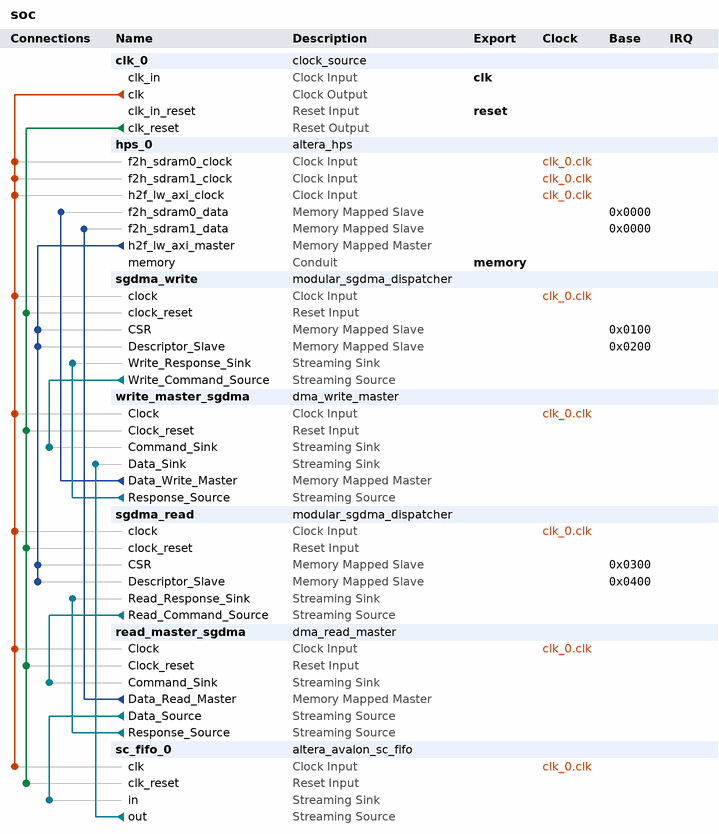
[diagram p0: system contents]
# Platform Designer (Qsys) system soc, Cyclone V 5CSXFC6D6F31C6
# Parameters at their usual value, and those the tool derives, are not listed.
package require -exact qsys 15.0
create_system soc
set_project_property DEVICE_FAMILY {Cyclone V}
set_project_property DEVICE 5CSXFC6D6F31C6

add_instance clk_0 clock_source 15.0
set_instance_parameter_value clk_0 clockFrequency 50000000

add_instance hps_0 altera_hps 15.0
set_instance_parameter_value hps_0 EMAC1_Mode N/A
set_instance_parameter_value hps_0 EMAC1_PinMuxing Unused
set_instance_parameter_value hps_0 F2SCLK_COLDRST_Enable false
set_instance_parameter_value hps_0 F2SCLK_DBGRST_Enable false
set_instance_parameter_value hps_0 F2SCLK_WARMRST_Enable false
set_instance_parameter_value hps_0 F2SDRAM_Type {Avalon-MM Write-Only,Avalon-MM Read-Only}
set_instance_parameter_value hps_0 F2SDRAM_Width 64,64
set_instance_parameter_value hps_0 F2SINTERRUPT_Enable false
set_instance_parameter_value hps_0 F2S_Width 0
set_instance_parameter_value hps_0 FPGA_PERIPHERAL_OUTPUT_CLOCK_FREQ_EMAC0_GTX_CLK 100
set_instance_parameter_value hps_0 FPGA_PERIPHERAL_OUTPUT_CLOCK_FREQ_EMAC0_MD_CLK 2.5
set_instance_parameter_value hps_0 FPGA_PERIPHERAL_OUTPUT_CLOCK_FREQ_EMAC1_GTX_CLK 100
set_instance_parameter_value hps_0 FPGA_PERIPHERAL_OUTPUT_CLOCK_FREQ_EMAC1_MD_CLK 2.5
set_instance_parameter_value hps_0 HPS_PROTOCOL DDR3
set_instance_parameter_value hps_0 I2C0_Mode N/A
set_instance_parameter_value hps_0 I2C0_PinMuxing Unused
set_instance_parameter_value hps_0 I2C1_Mode N/A
set_instance_parameter_value hps_0 I2C1_PinMuxing Unused
set_instance_parameter_value hps_0 LWH2F_Enable true
set_instance_parameter_value hps_0 MEM_BANKADDR_WIDTH 3
set_instance_parameter_value hps_0 MEM_CLK_FREQ 400.0
set_instance_parameter_value hps_0 MEM_COL_ADDR_WIDTH 10
set_instance_parameter_value hps_0 MEM_DQ_WIDTH 32
set_instance_parameter_value hps_0 MEM_DRV_STR RZQ/6
set_instance_parameter_value hps_0 MEM_ROW_ADDR_WIDTH 15
set_instance_parameter_value hps_0 MEM_RTT_NOM RZQ/6
set_instance_parameter_value hps_0 MEM_RTT_WR {Dynamic ODT off}
set_instance_parameter_value hps_0 MEM_TCL 7
set_instance_parameter_value hps_0 MEM_TFAW_NS 30.0
set_instance_parameter_value hps_0 MEM_TRAS_NS 35.0
set_instance_parameter_value hps_0 MEM_TRCD_NS 13.75
set_instance_parameter_value hps_0 MEM_TRFC_NS 260.0
set_instance_parameter_value hps_0 MEM_TRP_NS 13.75
set_instance_parameter_value hps_0 MEM_TRRD_NS 10.0
set_instance_parameter_value hps_0 MEM_TRTP_NS 10.0
set_instance_parameter_value hps_0 MEM_VENDOR JEDEC
set_instance_parameter_value hps_0 MEM_WTCL 6
set_instance_parameter_value hps_0 QSPI_Mode N/A
set_instance_parameter_value hps_0 QSPI_PinMuxing Unused
set_instance_parameter_value hps_0 REF_CLK_FREQ 25.0
set_instance_parameter_value hps_0 S2F_Width 0
set_instance_parameter_value hps_0 SDIO_Mode N/A
set_instance_parameter_value hps_0 SDIO_PinMuxing Unused
set_instance_parameter_value hps_0 SPIM1_Mode N/A
set_instance_parameter_value hps_0 SPIM1_PinMuxing Unused
set_instance_parameter_value hps_0 STM_Enable false
set_instance_parameter_value hps_0 TIMING_BOARD_AC_SKEW 0.03
set_instance_parameter_value hps_0 TIMING_BOARD_AC_TO_CK_SKEW 0.0
set_instance_parameter_value hps_0 TIMING_BOARD_DQ_TO_DQS_SKEW 0.0
set_instance_parameter_value hps_0 TIMING_BOARD_MAX_CK_DELAY 0.03
set_instance_parameter_value hps_0 TIMING_BOARD_MAX_DQS_DELAY 0.02
set_instance_parameter_value hps_0 TIMING_BOARD_SKEW_BETWEEN_DQS 0.08
set_instance_parameter_value hps_0 TIMING_BOARD_SKEW_CKDQS_DIMM_MAX 0.16
set_instance_parameter_value hps_0 TIMING_BOARD_SKEW_CKDQS_DIMM_MIN 0.09
set_instance_parameter_value hps_0 TIMING_BOARD_SKEW_WITHIN_DQS 0.01
set_instance_parameter_value hps_0 TIMING_TDH 65
set_instance_parameter_value hps_0 TIMING_TDQSCK 255
set_instance_parameter_value hps_0 TIMING_TDQSQ 125
set_instance_parameter_value hps_0 TIMING_TDS 30
set_instance_parameter_value hps_0 TIMING_TIH 140
set_instance_parameter_value hps_0 TIMING_TIS 180
set_instance_parameter_value hps_0 TIMING_TQSH 0.4
set_instance_parameter_value hps_0 UART0_Mode N/A
set_instance_parameter_value hps_0 UART0_PinMuxing Unused
set_instance_parameter_value hps_0 USB1_Mode N/A
set_instance_parameter_value hps_0 USB1_PinMuxing Unused
set_instance_parameter_value hps_0 desired_cfg_clk_mhz 100.0
set_instance_parameter_value hps_0 desired_qspi_clk_mhz 400.0

add_instance sgdma_write modular_sgdma_dispatcher 15.0
set_instance_parameter_value sgdma_write BURST_ENABLE 0
set_instance_parameter_value sgdma_write BURST_WRAPPING_SUPPORT 0
set_instance_parameter_value sgdma_write CSR_ADDRESS_WIDTH 3
set_instance_parameter_value sgdma_write DATA_FIFO_DEPTH 32
set_instance_parameter_value sgdma_write DATA_WIDTH 32
set_instance_parameter_value sgdma_write DESCRIPTOR_FIFO_DEPTH 8
set_instance_parameter_value sgdma_write ENHANCED_FEATURES 0
set_instance_parameter_value sgdma_write GUI_RESPONSE_PORT 2
set_instance_parameter_value sgdma_write MAX_BURST_COUNT 2
set_instance_parameter_value sgdma_write MAX_BYTE 1024
set_instance_parameter_value sgdma_write MAX_STRIDE 1
set_instance_parameter_value sgdma_write MODE 2
set_instance_parameter_value sgdma_write PROGRAMMABLE_BURST_ENABLE 0
set_instance_parameter_value sgdma_write STRIDE_ENABLE 0
set_instance_parameter_value sgdma_write TRANSFER_TYPE {Aligned Accesses}

add_instance write_master_sgdma dma_write_master 15.0
set_instance_parameter_value write_master_sgdma BURST_ENABLE 0
set_instance_parameter_value write_master_sgdma DATA_WIDTH 64
set_instance_parameter_value write_master_sgdma ERROR_ENABLE 1
set_instance_parameter_value write_master_sgdma ERROR_WIDTH 8
set_instance_parameter_value write_master_sgdma FIFO_DEPTH 128
set_instance_parameter_value write_master_sgdma FIFO_SPEED_OPTIMIZATION 1
set_instance_parameter_value write_master_sgdma GUI_BURST_WRAPPING_SUPPORT 0
set_instance_parameter_value write_master_sgdma GUI_MAX_BURST_COUNT 2
set_instance_parameter_value write_master_sgdma GUI_PROGRAMMABLE_BURST_ENABLE 0
set_instance_parameter_value write_master_sgdma GUI_STRIDE_WIDTH 1
set_instance_parameter_value write_master_sgdma LENGTH_WIDTH 32
set_instance_parameter_value write_master_sgdma PACKET_ENABLE 0
set_instance_parameter_value write_master_sgdma STRIDE_ENABLE 0
set_instance_parameter_value write_master_sgdma TRANSFER_TYPE {Aligned Accesses}

add_instance sgdma_read modular_sgdma_dispatcher 15.0
set_instance_parameter_value sgdma_read BURST_ENABLE 0
set_instance_parameter_value sgdma_read BURST_WRAPPING_SUPPORT 0
set_instance_parameter_value sgdma_read CSR_ADDRESS_WIDTH 3
set_instance_parameter_value sgdma_read DATA_FIFO_DEPTH 32
set_instance_parameter_value sgdma_read DATA_WIDTH 32
set_instance_parameter_value sgdma_read DESCRIPTOR_FIFO_DEPTH 8
set_instance_parameter_value sgdma_read ENHANCED_FEATURES 0
set_instance_parameter_value sgdma_read GUI_RESPONSE_PORT 0
set_instance_parameter_value sgdma_read MAX_BURST_COUNT 2
set_instance_parameter_value sgdma_read MAX_BYTE 1024
set_instance_parameter_value sgdma_read MAX_STRIDE 1
set_instance_parameter_value sgdma_read MODE 1
set_instance_parameter_value sgdma_read PROGRAMMABLE_BURST_ENABLE 0
set_instance_parameter_value sgdma_read STRIDE_ENABLE 0
set_instance_parameter_value sgdma_read TRANSFER_TYPE {Aligned Accesses}

add_instance read_master_sgdma dma_read_master 15.0
set_instance_parameter_value read_master_sgdma BURST_ENABLE 0
set_instance_parameter_value read_master_sgdma CHANNEL_ENABLE 1
set_instance_parameter_value read_master_sgdma CHANNEL_WIDTH 8
set_instance_parameter_value read_master_sgdma DATA_WIDTH 64
set_instance_parameter_value read_master_sgdma ERROR_ENABLE 1
set_instance_parameter_value read_master_sgdma ERROR_WIDTH 8
set_instance_parameter_value read_master_sgdma FIFO_DEPTH 128
set_instance_parameter_value read_master_sgdma FIFO_SPEED_OPTIMIZATION 1
set_instance_parameter_value read_master_sgdma GUI_BURST_WRAPPING_SUPPORT 0
set_instance_parameter_value read_master_sgdma GUI_MAX_BURST_COUNT 2
set_instance_parameter_value read_master_sgdma GUI_PROGRAMMABLE_BURST_ENABLE 0
set_instance_parameter_value read_master_sgdma GUI_STRIDE_WIDTH 1
set_instance_parameter_value read_master_sgdma LENGTH_WIDTH 32
set_instance_parameter_value read_master_sgdma PACKET_ENABLE 0
set_instance_parameter_value read_master_sgdma STRIDE_ENABLE 0
set_instance_parameter_value read_master_sgdma TRANSFER_TYPE {Aligned Accesses}

add_instance sc_fifo_0 altera_avalon_sc_fifo 15.0
set_instance_parameter_value sc_fifo_0 BITS_PER_SYMBOL 8
set_instance_parameter_value sc_fifo_0 CHANNEL_WIDTH 8
set_instance_parameter_value sc_fifo_0 ERROR_WIDTH 8
set_instance_parameter_value sc_fifo_0 FIFO_DEPTH 256
set_instance_parameter_value sc_fifo_0 SYMBOLS_PER_BEAT 8
set_instance_parameter_value sc_fifo_0 USE_FILL_LEVEL 0
set_instance_parameter_value sc_fifo_0 USE_MEMORY_BLOCKS 1
set_instance_parameter_value sc_fifo_0 USE_STORE_FORWARD 0

# connections
add_connection clk_0.clk hps_0.f2h_sdram0_clock clock
add_connection clk_0.clk hps_0.f2h_sdram1_clock clock
add_connection clk_0.clk hps_0.h2f_lw_axi_clock clock
add_connection clk_0.clk read_master_sgdma.Clock clock
add_connection clk_0.clk sc_fifo_0.clk clock
add_connection clk_0.clk sgdma_read.clock clock
add_connection clk_0.clk sgdma_write.clock clock
add_connection clk_0.clk write_master_sgdma.Clock clock
add_connection clk_0.clk_reset read_master_sgdma.Clock_reset reset
add_connection clk_0.clk_reset sc_fifo_0.clk_reset reset
add_connection clk_0.clk_reset sgdma_read.clock_reset reset
add_connection clk_0.clk_reset sgdma_write.clock_reset reset
add_connection clk_0.clk_reset write_master_sgdma.Clock_reset reset
add_connection hps_0.h2f_lw_axi_master sgdma_read.CSR avalon
set_connection_parameter_value hps_0.h2f_lw_axi_master/sgdma_read.CSR baseAddress 0x0300
add_connection hps_0.h2f_lw_axi_master sgdma_read.Descriptor_Slave avalon
set_connection_parameter_value hps_0.h2f_lw_axi_master/sgdma_read.Descriptor_Slave baseAddress 0x0400
add_connection hps_0.h2f_lw_axi_master sgdma_write.CSR avalon
set_connection_parameter_value hps_0.h2f_lw_axi_master/sgdma_write.CSR baseAddress 0x0100
add_connection hps_0.h2f_lw_axi_master sgdma_write.Descriptor_Slave avalon
set_connection_parameter_value hps_0.h2f_lw_axi_master/sgdma_write.Descriptor_Slave baseAddress 0x0200
add_connection read_master_sgdma.Data_Read_Master hps_0.f2h_sdram1_data avalon
set_connection_parameter_value read_master_sgdma.Data_Read_Master/hps_0.f2h_sdram1_data baseAddress 0x0000
add_connection write_master_sgdma.Data_Write_Master hps_0.f2h_sdram0_data avalon
set_connection_parameter_value write_master_sgdma.Data_Write_Master/hps_0.f2h_sdram0_data baseAddress 0x0000
add_connection read_master_sgdma.Data_Source sc_fifo_0.in avalon_streaming
add_connection read_master_sgdma.Response_Source sgdma_read.Read_Response_Sink avalon_streaming
add_connection sc_fifo_0.out write_master_sgdma.Data_Sink avalon_streaming
add_connection sgdma_read.Read_Command_Source read_master_sgdma.Command_Sink avalon_streaming
add_connection sgdma_write.Write_Command_Source write_master_sgdma.Command_Sink avalon_streaming
add_connection write_master_sgdma.Response_Source sgdma_write.Write_Response_Sink avalon_streaming

# exported interfaces
add_interface clk clock sink
set_interface_property clk EXPORT_OF clk_0.clk_in
add_interface memory conduit end
set_interface_property memory EXPORT_OF hps_0.memory
add_interface reset reset sink
set_interface_property reset EXPORT_OF clk_0.clk_in_reset

set_interconnect_requirement {$system} qsys_mm.clockCrossingAdapter HANDSHAKE
set_interconnect_requirement {$system} qsys_mm.enableEccProtection FALSE
set_interconnect_requirement {$system} qsys_mm.insertDefaultSlave FALSE
set_interconnect_requirement {$system} qsys_mm.maxAdditionalLatency 1
set_interconnect_requirement hps_0.f2h_sdram0_data qsys_mm.security SECURE
set_interconnect_requirement hps_0.f2h_sdram1_data qsys_mm.security SECURE
set_interconnect_requirement read_master_sgdma.Data_Read_Master qsys_mm.security SECURE
set_interconnect_requirement write_master_sgdma.Data_Write_Master qsys_mm.security SECURE

save_system soc.qsys
